# Altium schematic sheet Power Meter.SchDoc: Power Meter
size A2; ApprovedBy: JTS; CheckedBy: JTS; DrawnBy: EBC; DocumentNumber: -; Revision: 09; SheetNumber: 3; SheetTotal: 7; SenaiProjectName: EzPower v4
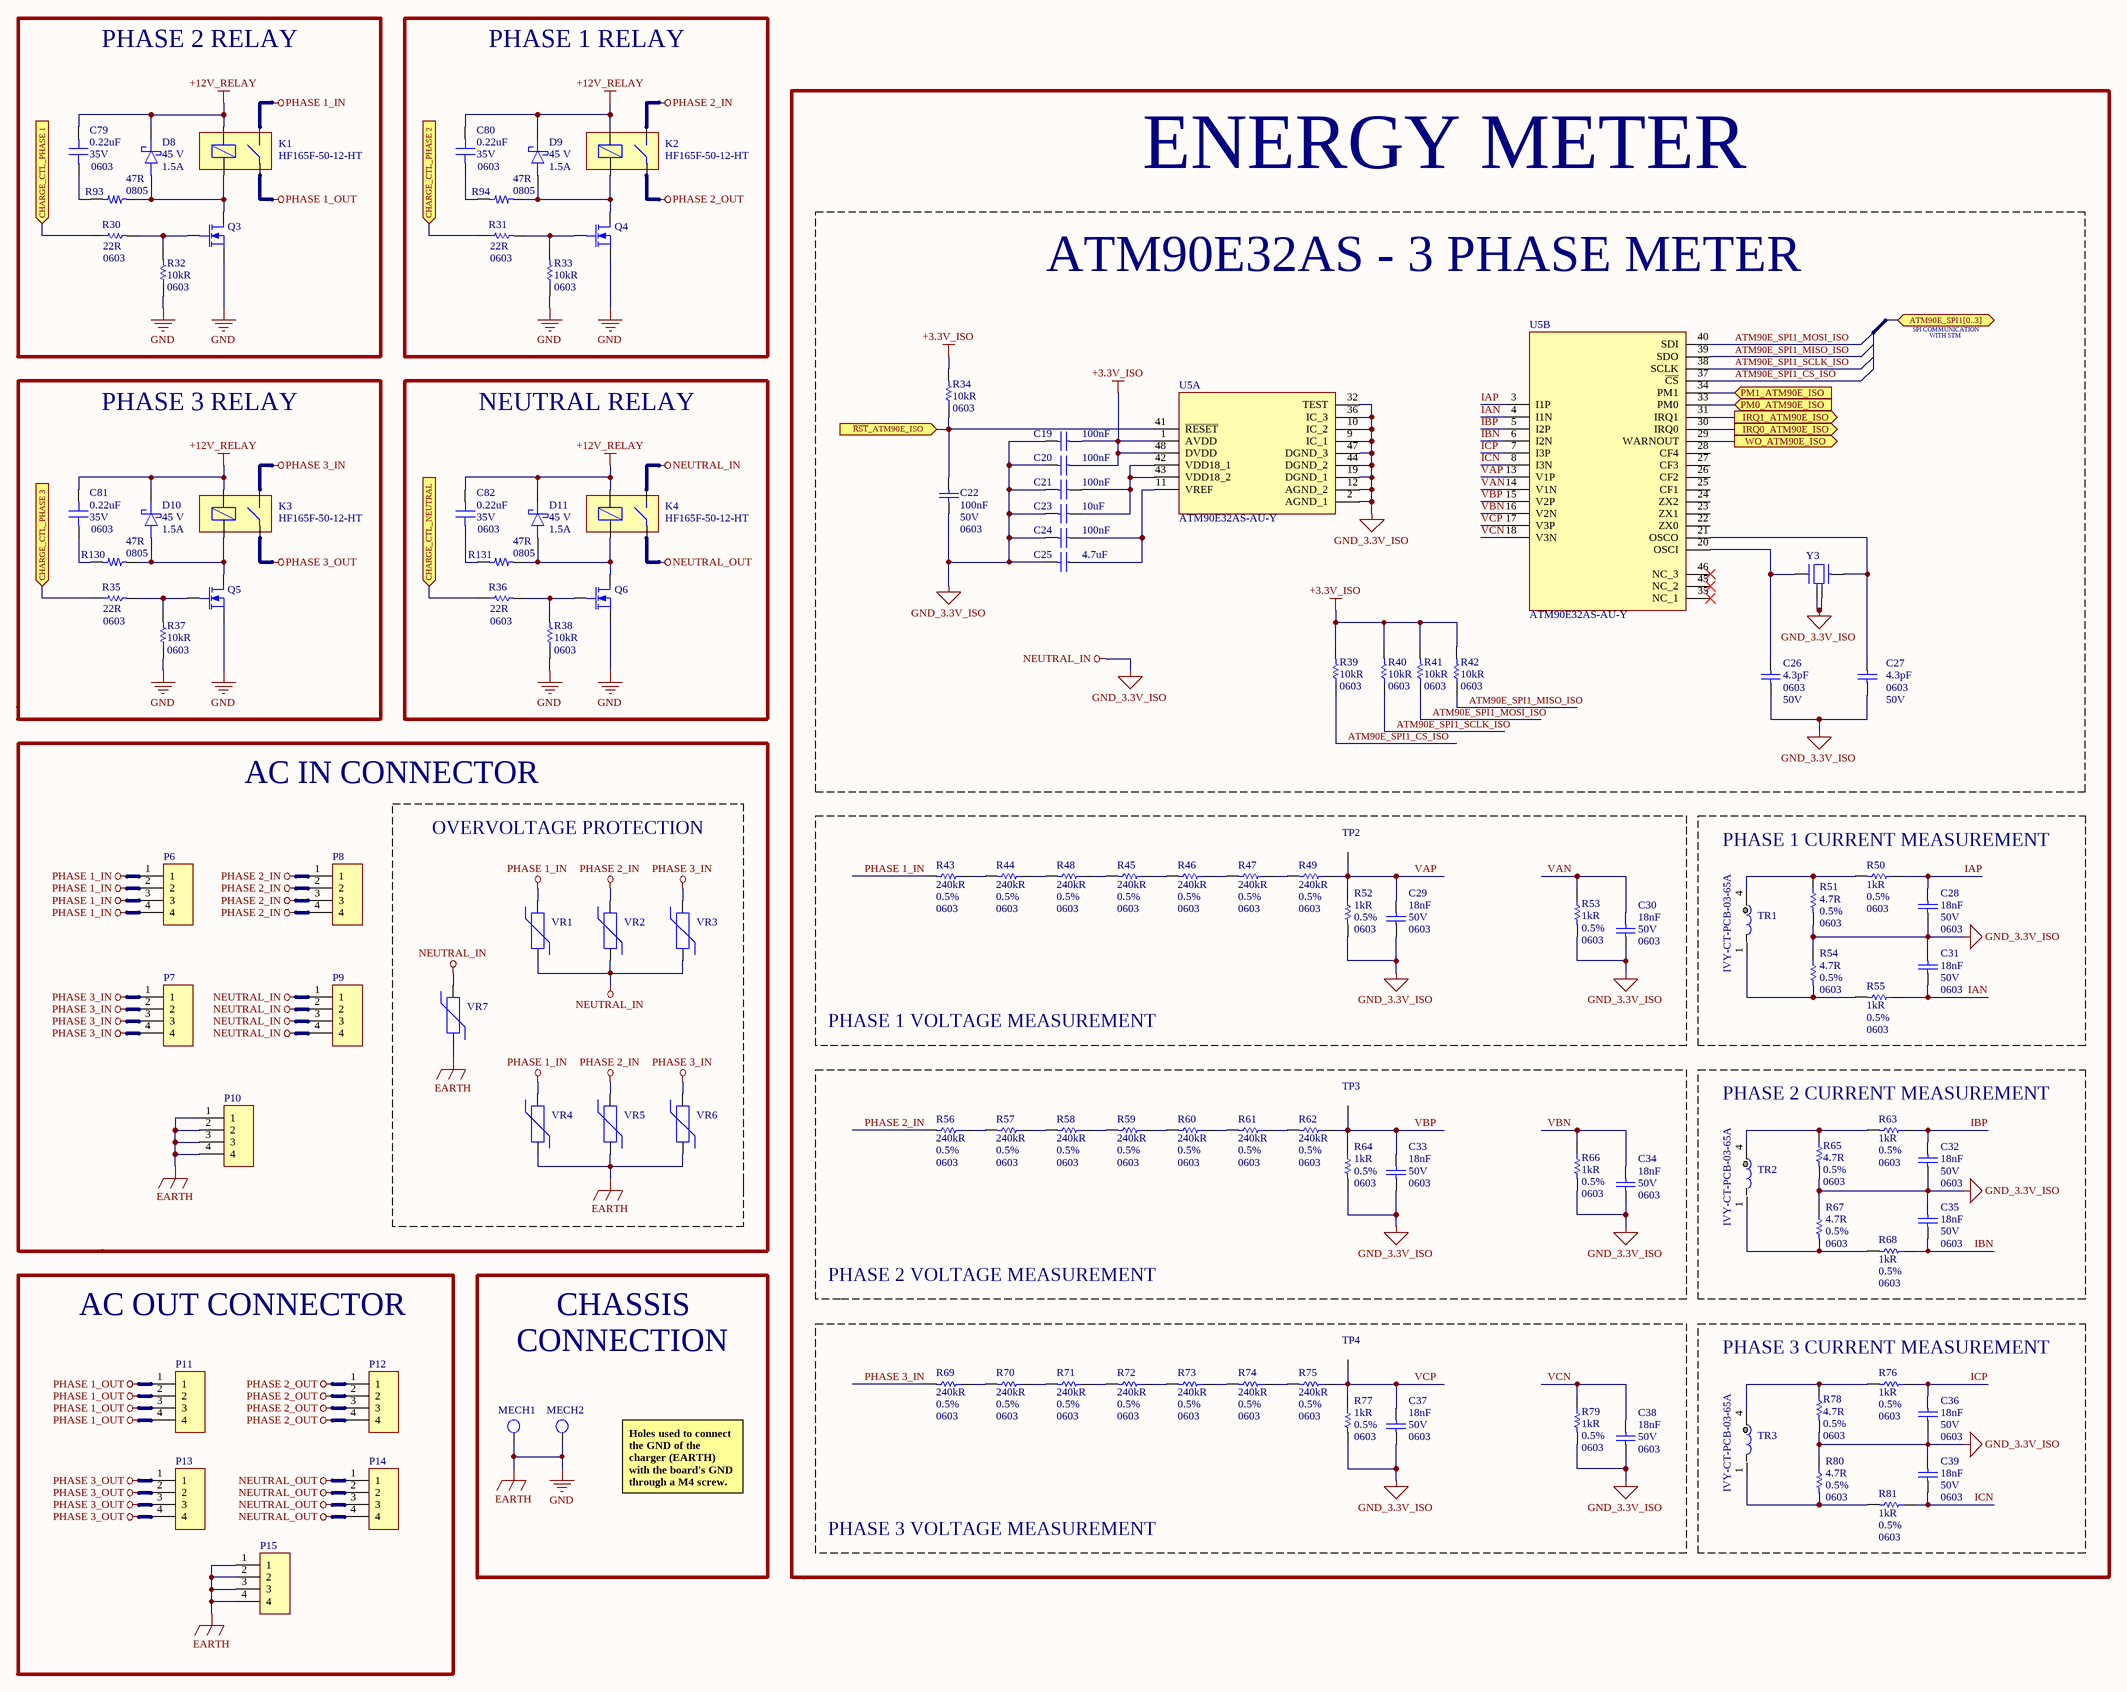
[diagram p0: Power Meter.SchDoc]

## Parts
C19  value 100nF  [C0603]  (hidden comment: CC0603MRX7R9BB104)
C20  value 100nF  [C0603]  (hidden comment: CC0603MRX7R9BB104)
C21  value 100nF  [C0603]  (hidden comment: CC0603MRX7R9BB104)
C22  value 100nF  Case/Package: 0603  Voltage Rating: 50V  [C0603]  (hidden comment: CC0603MRX7R9BB104)
C23  Capacitance: 10uF  [C0603]  (hidden comment: C_0603_10uF_35V_20%)
C24  value 100nF  [C0603]  (hidden comment: CC0603MRX7R9BB104)
C25  value 4.7uF  [C0603]  (hidden comment: CL10A475KO8NNNC)
C26  value 4.3pF  Case Code (Imperial): 0603  Voltage Rating: 50V  [C0603]  (hidden comment: CC0603CRNPO9BN4R3)
C27  value 4.3pF  Case Code (Imperial): 0603  Voltage Rating: 50V  [C0603]  (hidden comment: CC0603CRNPO9BN4R3)
C28  value 18nF  Voltage Rating: 50V  Case/Package: 0603  [C0603]  (hidden comment: CC0603JRX7R9BB183)
C29  value 18nF  Voltage Rating: 50V  Case/Package: 0603  [C0603]  (hidden comment: CC0603JRX7R9BB183)
C30  value 18nF  Voltage Rating: 50V  Case/Package: 0603  [C0603]  (hidden comment: CC0603JRX7R9BB183)
C31  value 18nF  Voltage Rating: 50V  Case/Package: 0603  [C0603]  (hidden comment: CC0603JRX7R9BB183)
C32  value 18nF  Voltage Rating: 50V  Case/Package: 0603  [C0603]  (hidden comment: CC0603JRX7R9BB183)
C33  value 18nF  Voltage Rating: 50V  Case/Package: 0603  [C0603]  (hidden comment: CC0603JRX7R9BB183)
C34  value 18nF  Voltage Rating: 50V  Case/Package: 0603  [C0603]  (hidden comment: CC0603JRX7R9BB183)
C35  value 18nF  Voltage Rating: 50V  Case/Package: 0603  [C0603]  (hidden comment: CC0603JRX7R9BB183)
C36  value 18nF  Voltage Rating: 50V  Case/Package: 0603  [C0603]  (hidden comment: CC0603JRX7R9BB183)
C37  value 18nF  Voltage Rating: 50V  Case/Package: 0603  [C0603]  (hidden comment: CC0603JRX7R9BB183)
C38  value 18nF  Voltage Rating: 50V  Case/Package: 0603  [C0603]  (hidden comment: CC0603JRX7R9BB183)
C39  value 18nF  Voltage Rating: 50V  Case/Package: 0603  [C0603]  (hidden comment: CC0603JRX7R9BB183)
C79  Parameter 1: 0.22uF  Parameter 2: 35V  Package: 0603  [CAPC 0603/1608]  (hidden comment: Capacitor)
C80  Parameter 1: 0.22uF  Parameter 2: 35V  Package: 0603  [CAPC 0603/1608]  (hidden comment: Capacitor)
C81  Parameter 1: 0.22uF  Parameter 2: 35V  Package: 0603  [CAPC 0603/1608]  (hidden comment: Capacitor)
C82  Parameter 1: 0.22uF  Parameter 2: 35V  Package: 0603  [CAPC 0603/1608]  (hidden comment: Capacitor)
D8  Voltage: 45 V  Current: 1.5A  [DO-214AC-2]  (hidden comment: BYS10-45HE3_A/H)
D9  Voltage: 45 V  Current: 1.5A  [DO-214AC-2]  (hidden comment: BYS10-45HE3_A/H)
D10  Voltage: 45 V  Current: 1.5A  [DO-214AC-2]  (hidden comment: BYS10-45HE3_A/H)
D11  Voltage: 45 V  Current: 1.5A  [DO-214AC-2]  (hidden comment: BYS10-45HE3_A/H)
K1  HF165F-50-12-HT  [HF165F-50 12-HT]
K2  HF165F-50-12-HT  [HF165F-50 12-HT]
K3  HF165F-50-12-HT  [HF165F-50 12-HT]
K4  HF165F-50-12-HT  [HF165F-50 12-HT]
MECH1  MECH-Screw-M4  [MECH-M4]  (value not drawn)
MECH2  MECH-Screw-M4  [MECH-M4]  (value not drawn)
P6  PCB-15  [Connector POWER PCB-15]  (value not drawn)
P7  PCB-15  [Connector POWER PCB-15]  (value not drawn)
P8  PCB-15  [Connector POWER PCB-15]  (value not drawn)
P9  PCB-15  [Connector POWER PCB-15]  (value not drawn)
P10  PCB-15  [Connector POWER PCB-15]  (value not drawn)
P11  PCB-15  [Connector POWER PCB-15]  (value not drawn)
P12  PCB-15  [Connector POWER PCB-15]  (value not drawn)
P13  PCB-15  [Connector POWER PCB-15]  (value not drawn)
P14  PCB-15  [Connector POWER PCB-15]  (value not drawn)
P15  PCB-15  [Connector POWER PCB-15]  (value not drawn)
Q3  RSF015N06FRATL  [TUMT-3]  (value not drawn)
Q4  RSF015N06FRATL  [TUMT-3]  (value not drawn)
Q5  RSF015N06FRATL  [TUMT-3]  (value not drawn)
Q6  RSF015N06FRATL  [TUMT-3]  (value not drawn)
R30  Resistance: 22R  Case Code (Imperial): 0603  [R0603]  (hidden comment: CRCW060322R0FKEAC)
R31  Resistance: 22R  Case Code (Imperial): 0603  [R0603]  (hidden comment: CRCW060322R0FKEAC)
R32  value 10kR  Case/Package: 0603  [R0603]  (hidden comment: CRCW060310K0JNEBC)
R33  value 10kR  Case/Package: 0603  [R0603]  (hidden comment: CRCW060310K0JNEBC)
R34  value 10kR  Case/Package: 0603  [R0603]  (hidden comment: CRCW060310K0JNEBC)
R35  Resistance: 22R  Case Code (Imperial): 0603  [R0603]  (hidden comment: CRCW060322R0FKEAC)
R36  Resistance: 22R  Case Code (Imperial): 0603  [R0603]  (hidden comment: CRCW060322R0FKEAC)
R37  value 10kR  Case/Package: 0603  [R0603]  (hidden comment: CRCW060310K0JNEBC)
R38  value 10kR  Case/Package: 0603  [R0603]  (hidden comment: CRCW060310K0JNEBC)
R39  value 10kR  Case/Package: 0603  [R0603]  (hidden comment: CRCW060310K0JNEBC)
R40  value 10kR  Case/Package: 0603  [R0603]  (hidden comment: CRCW060310K0JNEBC)
R41  value 10kR  Case/Package: 0603  [R0603]  (hidden comment: CRCW060310K0JNEBC)
R42  value 10kR  Case/Package: 0603  [R0603]  (hidden comment: CRCW060310K0JNEBC)
R43  value 240kR  Tolerance: 0.5%  Case Code (Imperial): 0603  [R0603]  (hidden comment: RR0816P-244-D)
R44  value 240kR  Tolerance: 0.5%  Case Code (Imperial): 0603  [R0603]  (hidden comment: RR0816P-244-D)
R45  value 240kR  Tolerance: 0.5%  Case Code (Imperial): 0603  [R0603]  (hidden comment: RR0816P-244-D)
R46  value 240kR  Tolerance: 0.5%  Case Code (Imperial): 0603  [R0603]  (hidden comment: RR0816P-244-D)
R47  value 240kR  Tolerance: 0.5%  Case Code (Imperial): 0603  [R0603]  (hidden comment: RR0816P-244-D)
R48  value 240kR  Tolerance: 0.5%  Case Code (Imperial): 0603  [R0603]  (hidden comment: RR0816P-244-D)
R49  value 240kR  Tolerance: 0.5%  Case Code (Imperial): 0603  [R0603]  (hidden comment: RR0816P-244-D)
R50  value 1kR  Case/Package: 0603  Resistance Tolerance: 0.5%  [R0603]  (hidden comment: RR0816P-102-D)
R51  value 4.7R  Tolerance: 0.5%  Case/Package: 0603  [R0603]  (hidden comment: R_0603_4.7R_0.5%_1/10W)
R52  value 1kR  Case/Package: 0603  Resistance Tolerance: 0.5%  [R0603]  (hidden comment: RR0816P-102-D)
R53  value 1kR  Case/Package: 0603  Resistance Tolerance: 0.5%  [R0603]  (hidden comment: RR0816P-102-D)
R54  value 4.7R  Tolerance: 0.5%  Case/Package: 0603  [R0603]  (hidden comment: R_0603_4.7R_0.5%_1/10W)
R55  value 1kR  Case/Package: 0603  Resistance Tolerance: 0.5%  [R0603]  (hidden comment: RR0816P-102-D)
R56  value 240kR  Tolerance: 0.5%  Case Code (Imperial): 0603  [R0603]  (hidden comment: RR0816P-244-D)
R57  value 240kR  Tolerance: 0.5%  Case Code (Imperial): 0603  [R0603]  (hidden comment: RR0816P-244-D)
R58  value 240kR  Tolerance: 0.5%  Case Code (Imperial): 0603  [R0603]  (hidden comment: RR0816P-244-D)
R59  value 240kR  Tolerance: 0.5%  Case Code (Imperial): 0603  [R0603]  (hidden comment: RR0816P-244-D)
R60  value 240kR  Tolerance: 0.5%  Case Code (Imperial): 0603  [R0603]  (hidden comment: RR0816P-244-D)
R61  value 240kR  Tolerance: 0.5%  Case Code (Imperial): 0603  [R0603]  (hidden comment: RR0816P-244-D)
R62  value 240kR  Tolerance: 0.5%  Case Code (Imperial): 0603  [R0603]  (hidden comment: RR0816P-244-D)
R63  value 1kR  Case/Package: 0603  Resistance Tolerance: 0.5%  [R0603]  (hidden comment: RR0816P-102-D)
R64  value 1kR  Case/Package: 0603  Resistance Tolerance: 0.5%  [R0603]  (hidden comment: RR0816P-102-D)
R65  value 4.7R  Tolerance: 0.5%  Case/Package: 0603  [R0603]  (hidden comment: R_0603_4.7R_0.5%_1/10W)
R66  value 1kR  Case/Package: 0603  Resistance Tolerance: 0.5%  [R0603]  (hidden comment: RR0816P-102-D)
R67  value 4.7R  Tolerance: 0.5%  Case/Package: 0603  [R0603]  (hidden comment: R_0603_4.7R_0.5%_1/10W)
R68  value 1kR  Case/Package: 0603  Resistance Tolerance: 0.5%  [R0603]  (hidden comment: RR0816P-102-D)
R69  value 240kR  Tolerance: 0.5%  Case Code (Imperial): 0603  [R0603]  (hidden comment: RR0816P-244-D)
R70  value 240kR  Tolerance: 0.5%  Case Code (Imperial): 0603  [R0603]  (hidden comment: RR0816P-244-D)
R71  value 240kR  Tolerance: 0.5%  Case Code (Imperial): 0603  [R0603]  (hidden comment: RR0816P-244-D)
R72  value 240kR  Tolerance: 0.5%  Case Code (Imperial): 0603  [R0603]  (hidden comment: RR0816P-244-D)
R73  value 240kR  Tolerance: 0.5%  Case Code (Imperial): 0603  [R0603]  (hidden comment: RR0816P-244-D)
R74  value 240kR  Tolerance: 0.5%  Case Code (Imperial): 0603  [R0603]  (hidden comment: RR0816P-244-D)
R75  value 240kR  Tolerance: 0.5%  Case Code (Imperial): 0603  [R0603]  (hidden comment: RR0816P-244-D)
R76  value 1kR  Case/Package: 0603  Resistance Tolerance: 0.5%  [R0603]  (hidden comment: RR0816P-102-D)
R77  value 1kR  Case/Package: 0603  Resistance Tolerance: 0.5%  [R0603]  (hidden comment: RR0816P-102-D)
R78  value 4.7R  Tolerance: 0.5%  Case/Package: 0603  [R0603]  (hidden comment: R_0603_4.7R_0.5%_1/10W)
R79  value 1kR  Case/Package: 0603  Resistance Tolerance: 0.5%  [R0603]  (hidden comment: RR0816P-102-D)
R80  value 4.7R  Tolerance: 0.5%  Case/Package: 0603  [R0603]  (hidden comment: R_0603_4.7R_0.5%_1/10W)
R81  value 1kR  Case/Package: 0603  Resistance Tolerance: 0.5%  [R0603]  (hidden comment: RR0816P-102-D)
R93  Parameter 2: 0805  Parameter 1: 47R  [RESC 0805/2012]  (hidden comment: Resistor)
R94  Parameter 2: 0805  Parameter 1: 47R  [RESC 0805/2012]  (hidden comment: Resistor)
R130  Parameter 2: 0805  Parameter 1: 47R  [RESC 0805/2012]  (hidden comment: Resistor)
R131  Parameter 2: 0805  Parameter 1: 47R  [RESC 0805/2012]  (hidden comment: Resistor)
TP2  S2761-46R  [TP_S276146R]  (value not drawn)
TP3  S2761-46R  [TP_S276146R]  (value not drawn)
TP4  S2761-46R  [TP_S276146R]  (value not drawn)
TR1  IVY-CT-PCB-03-65A  [CT IVY]
TR2  IVY-CT-PCB-03-65A  [CT IVY]
TR3  IVY-CT-PCB-03-65A  [CT IVY]
U5  Manufacturer Part Number: ATM90E32AS-AU-Y  [TQFP-48]  (hidden comment: ATM90E32AS)  (parts A,B of 2)
VR1  B72650M0271K072  [MOV3225]  (value not drawn)
VR2  B72650M0271K072  [MOV3225]  (value not drawn)
VR3  B72650M0271K072  [MOV3225]  (value not drawn)
VR4  B72650M0271K072  [MOV3225]  (value not drawn)
VR5  B72650M0271K072  [MOV3225]  (value not drawn)
VR6  B72650M0271K072  [MOV3225]  (value not drawn)
VR7  B72650M0271K072  [MOV3225]  (value not drawn)
Y3  Y_16.384MHZ  [Y50MHz]  (value not drawn)

## Blocks framed on the sheet
PHASE 2 RELAY: C79 D8 K1 Q3 R30 R32 R93
PHASE 1 RELAY: C80 D9 K2 Q4 R31 R33 R94
ATM90E32AS - 3 PHASE METER: C19-C27 R34 R39-R42 U5 Y3
NEUTRAL RELAY: C82 D11 K4 Q6 R36 R38 R131
AC IN CONNECTOR: P6-P10 VR1-VR7
PHASE 1 VOLTAGE MEASUREMENT: C29 C30 R43-R49 R52 R53 TP2
PHASE 1 CURRENT MEASUREMENT: C28 C31 R50 R51 R54 R55 TR1
PHASE 2 VOLTAGE MEASUREMENT: C33 C34 R56-R62 R64 R66 TP3
PHASE 2 CURRENT MEASUREMENT: C32 C35 R63 R65 R67 R68 TR2
AC OUT CONNECTOR: P11-P15
PHASE 3 VOLTAGE MEASUREMENT: C37 C38 R69-R75 R77 R79 TP4
PHASE 3 CURRENT MEASUREMENT: C36 C39 R76 R78 R80 R81 TR3

## Ports
ATM90E_SPI1[0..3] (bidir), CHARGE_CTL_NEUTRAL (in), CHARGE_CTL_PHASE 1 (in), CHARGE_CTL_PHASE 2 (in), CHARGE_CTL_PHASE 3 (in), IRQ0_ATM90E_ISO (out), IRQ1_ATM90E_ISO (out), PM0_ATM90E_ISO (in), PM1_ATM90E_ISO (in), WO_ATM90E_ISO (out), ~{RST}_ATM90E_ISO (in)

## Nets
+3.3V_ISO: C19.2 C20.2 R34.2 R39.2 R40.2 R41.2 R42.2 U5.1(AVDD) U5.48(DVDD)
+12V_RELAY: C79.2 C80.2 C81.2 C82.2 D8.1(K) D9.1(K) D10.1(K) D11.1(K) K1.3(A1) K2.3(A1) K3.3(A1) K4.3(A1)
EARTH: MECH1.1 MECH2.1 P10.1 P10.2 P10.3 P10.4 P15.1 P15.2 P15.3 P15.4 Q3.2(S) Q4.2(S) Q5.2(S) Q6.2(S) R32.1 R33.1 R37.1 R38.1 VR4.2 VR5.2 VR6.2 VR7.2  [also labelled GND]
GND_3.3V_ISO: C19.1 C20.1 C21.1 C22.2 C23.2 C24.1 C25.2 C26.1 C27.1 C28.2 C29.2 C30.2 C31.1 C32.2 C33.2 C34.2 C35.1 C36.2 C37.2 C38.2 C39.1 K4.1(NO) P9.1 P9.2 P9.3 P9.4 R51.2 R52.2 R53.2 R54.1 R64.2 R65.2 R66.2 R67.1 R77.2 R78.2 R79.2 R80.1 U5.2(AGND_1) U5.9(IC_1) U5.10(IC_2) U5.12(AGND_2) U5.19(DGND_1) U5.32(TEST) U5.36(IC_3) U5.44(DGND_2) U5.47(DGND_3) VR1.2 VR2.2 VR3.2 VR7.1 Y3.2 Y3.4  [also labelled NEUTRAL_IN]
NEUTRAL_OUT: K4.2(C) P14.1 P14.2 P14.3 P14.4
PHASE 1_IN: K1.1(NO) P6.1 P6.2 P6.3 P6.4 R43.2 VR1.1 VR4.1
PHASE 1_OUT: K1.2(C) P11.1 P11.2 P11.3 P11.4
PHASE 2_IN: K2.1(NO) P8.1 P8.2 P8.3 P8.4 R56.2 VR2.1 VR5.1
PHASE 2_OUT: K2.2(C) P12.1 P12.2 P12.3 P12.4
PHASE 3_IN: K3.1(NO) P7.1 P7.2 P7.3 P7.4 R69.2 VR3.1 VR6.1
PHASE 3_OUT: K3.2(C) P13.1 P13.2 P13.3 P13.4
ATM90E_SPI1_CS_ISO: R39.1 U5.37(~{CS})
ATM90E_SPI1_MISO_ISO: R42.1 U5.39(SDO)
ATM90E_SPI1_MOSI_ISO: R41.1 U5.40(SDI)
ATM90E_SPI1_SCLK_ISO: R40.1 U5.38(SCLK)
CHARGE_CTL_NEUTRAL: R36.1 ; port CHARGE_CTL_NEUTRAL
CHARGE_CTL_PHASE 1: R30.1 ; port CHARGE_CTL_PHASE 1
CHARGE_CTL_PHASE 2: R31.1 ; port CHARGE_CTL_PHASE 2
CHARGE_CTL_PHASE 3: R35.1 ; port CHARGE_CTL_PHASE 3
IAN: C31.2 R55.1 U5.4(I1N)
IAP: C28.1 R50.1 U5.3(I1P)
IBN: C35.2 R68.1 U5.6(I2N)
IBP: C32.1 R63.1 U5.5(I2P)
ICN: C39.2 R81.1 U5.8(I3N)
ICP: C36.1 R76.1 U5.7(I3P)
IRQ0_ATM90E_ISO: U5.30(IRQ0) ; port IRQ0_ATM90E_ISO
IRQ1_ATM90E_ISO: U5.31(IRQ1) ; port IRQ1_ATM90E_ISO
PM0_ATM90E_ISO: U5.33(PM0) ; port PM0_ATM90E_ISO
PM1_ATM90E_ISO: U5.34(PM1) ; port PM1_ATM90E_ISO
~{RST}_ATM90E_ISO: C22.1 R34.1 U5.41(~{RESET}) ; port ~{RST}_ATM90E_ISO
VAN: C30.1 R53.1 U5.14(V1N)
VAP: C29.1 R49.1 R52.1 TP2.1 U5.13(V1P)
VBN: C34.1 R66.1 U5.16(V2N)
VBP: C33.1 R62.1 R64.1 TP3.1 U5.15(V2P)
VCN: C38.1 R79.1 U5.18(V3N)
VCP: C37.1 R75.1 R77.1 TP4.1 U5.17(V3P)
WO_ATM90E_ISO: U5.29(WARNOUT) ; port WO_ATM90E_ISO
NetC21_2: C21.2 C23.1 U5.42(VDD18_1) U5.43(VDD18_2)
NetC24_2: C24.2 C25.1 U5.11(VREF)
NetC26_2: C26.2 U5.20(OSCI) Y3.1
NetC27_2: C27.2 U5.21(OSCO) Y3.3
NetC79_1: C79.1 R93.2
NetC80_1: C80.1 R94.2
NetC81_1: C81.1 R130.2
NetC82_1: C82.1 R131.2
NetD8_2: D8.2(A) K1.4(A2) Q3.3(D) R93.1
NetD9_2: D9.2(A) K2.4(A2) Q4.3(D) R94.1
NetD10_2: D10.2(A) K3.4(A2) Q5.3(D) R130.1
NetD11_2: D11.2(A) K4.4(A2) Q6.3(D) R131.1
NetQ3_1: Q3.1(G) R30.2 R32.2
NetQ4_1: Q4.1(G) R31.2 R33.2
NetQ5_1: Q5.1(G) R35.2 R37.2
NetQ6_1: Q6.1(G) R36.2 R38.2
NetR43_1: R43.1 R44.2
NetR44_1: R44.1 R48.2
NetR45_1: R45.1 R46.2
NetR45_2: R45.2 R48.1
NetR46_1: R46.1 R47.2
NetR47_1: R47.1 R49.2
NetR50_2: R50.2 R51.1 TR1.4(K)
NetR54_2: R54.2 R55.2 TR1.1(I)
NetR56_1: R56.1 R57.2
NetR57_1: R57.1 R58.2
NetR58_1: R58.1 R59.2
NetR59_1: R59.1 R60.2
NetR60_1: R60.1 R61.2
NetR61_1: R61.1 R62.2
NetR63_2: R63.2 R65.1 TR2.4(K)
NetR67_2: R67.2 R68.2 TR2.1(I)
NetR69_1: R69.1 R70.2
NetR70_1: R70.1 R71.2
NetR71_1: R71.1 R72.2
NetR72_1: R72.1 R73.2
NetR73_1: R73.1 R74.2
NetR74_1: R74.1 R75.2
NetR76_2: R76.2 R78.1 TR3.4(K)
NetR80_2: R80.2 R81.2 TR3.1(I)

Not connected (* = marked no-connect by the designer): U5 22(ZX0) 23(ZX1) 24(ZX2) 25(CF1) 26(CF2) 27(CF3) 28(CF4) 35(NC_1)* 45(NC_2)* 46(NC_3)*

## Notes on the sheet
- ENERGY METER
- SPI COMMUNICATION
- WITH STM
- PHASE 3 RELAY
- OVERVOLTAGE PROTECTION
- CONNECTION
- CHASSIS
- Holes used to connect the GND of the charger (EARTH) with the board's GND through a M4 screw.
- Title:
- Size:
- Project:
- Revision:
- Date:
- Time:
- Variant:
- Drawn by:
- Checked by:
- A2
- Approved by:
- Sheet
- of

## Library data of the parts
C19-C22 C24 = C_0603_0.1uF_50V_20%: Cap Ceramic 50V 20% +Tol 20% -Tol X7R 15% TC 0.1uF SMD 0603; Manufacturer: Yageo; Supplier 1: Arrow Electronics; Manufacturer Part Number: CC0603MRX7R9BB104; RoHS: Yes; Category: Ceramic Capacitors; Stock 1: 19775; Pricing 1: 4000=0,00850, 8000=0,00780, 12000=0,00740, 28000=0,00700, 100000=0,00520 (USD); Mounting Technology: Surface Mount; Case Code (Imperial): 0603; Case Code (Metric): 1608; Min Operating Temperature: -55°C; Max Operating Temperature: 125°C; Packaging: Tape and Reel; Tolerance: 20%; Dielectric: X7R; Voltage Rating (DC): 50V; Series: CC; Length: 0.063inch; Width: 0.031inch; Thickness: 0.035inch; Lead Free: Lead Free; Halogen Free: Halogen Free; RoHS Compliant: Yes; ComponentLink1URL: http://www.yageo.com/documents/recent/UPY-GPHC_X7R_6.3V-to-50V_18.pdf?src-supplier=Digi-Key; ComponentLink1Description: http://www.yageo.com/documents/recent/UPY-GPHC_X7R_6.3V-to-50V_18.pdf?src-supplier=Digi-Key; ComponentLink2URL: https://www.yageo.com/upload/media/product/productsearch/datasheet/mlcc/UPY-GPHC_X7R_6.3V-to-50V_18.pdf?src-supplier=Digi-Key; ComponentLink2Description: https://www.yageo.com/upload/media/product/productsearch/datasheet/mlcc/UPY-GPHC_X7R_6.3V-to-50V_18.pdf?src-supplier=Digi-Key; ComponentLink3URL: http://www.yageo.com/exep/pages/download/literatures/ProductSelectionGuide%202014_Final_2.pdf?src-supplier=Digi-Key; ComponentLink3Description: http://www.yageo.com/exep/pages/download/literatures/ProductSelectionGuide%202014_Final_2.pdf?src-supplier=Digi-Key; Supplier Part Number 1: CC0603MRX7R9BB104
C23 = C_0603_10uF_35V_20%: Cap Ceramic 10uF 35V X5R 20% Pad SMD 0603 85C T/R; Manufacturer: Murata; Manufacturer Part Number: GRM188R6YA106MA73D; Supplier 1: Arrow Electronics; RoHS: Yes; Category: Ceramic Capacitors; Stock 1: 32291; Pricing 1: 1=0,31230, 10=0,18330, 25=0,18150, 100=0,12390, 250=0,12260, 500=0,08640, 1000=0,08550, 3000=0,07600, 6000=0,06650, 15000=0,06580, 30000=0,05360 (USD); Mount: Surface Mount; Case Code (Metric): 1608; Case Code (Imperial): 0603; Min Operating Temperature: -55°C; Max Operating Temperature: 85°C; Packaging: Tape and Reel; Voltage Rating (DC): 35V; Dielectric: X5R; Length: 0.063inch; Width: 0.031inch; Thickness: 0.039inch; RoHS Compliant: Yes; ComponentLink1URL: http://search.murata.co.jp/Ceramy/image/img/A01X/G101/ENG/GRM188R6YA106MA73-01.pdf?src-supplier=Future+Electronics; ComponentLink1Description: http://search.murata.co.jp/Ceramy/image/img/A01X/G101/ENG/GRM188R6YA106MA73-01.pdf?src-supplier=Future+Electronics; ComponentLink2URL: http://search.murata.co.jp/Ceramy/image/img/A01X/G101/ENG/GRM188R6YA106MA73-01.pdf?src-supplier=Digi-Key; ComponentLink2Description: http://search.murata.co.jp/Ceramy/image/img/A01X/G101/ENG/GRM188R6YA106MA73-01.pdf?src-supplier=Digi-Key; ComponentLink3URL: https://www.murata.com/~/media/webrenewal/support/library/catalog/products/capacitor/mlcc/c02e.ashx?la=en-us&src-supplier=Digi-Key; ComponentLink3Description: https://www.murata.com/~/media/webrenewal/support/library/catalog/products/capacitor/mlcc/c02e.ashx?la=en-us&src-supplier=Digi-Key; ComponentLink4URL: http://search.murata.co.jp/Ceramy/image/img/A01X/G101/ENG/GRM188R6YA106MA73-01.pdf?src-supplier=Mouser; ComponentLink4Description: http://search.murata.co.jp/Ceramy/image/img/A01X/G101/ENG/GRM188R6YA106MA73-01.pdf?src-supplier=Mouser; ComponentLink5URL: http://search.murata.co.jp/Ceramy/image/img/A01X/G101/ENG/GRM188R6YA106MA73-01.pdf?src-supplier=TTI; ComponentLink5Description: http://search.murata.co.jp/Ceramy/image/img/A01X/G101/ENG/GRM188R6YA106MA73-01.pdf?src-supplier=TTI; Tolerance: 20%; Supplier Part Number 1: GRM188R6YA106MA73D
C25 = C_0603_4.7uF_16V_10%: CAP CER 4.7UF 16V X5R 0603; Manufacturer: Samsung; Material: Ceramic; Tolerance: 10%; Supplier 1: Mouser; Manufacturer Part Number: CL10A475KO8NNNC; RoHS: Yes; Category: Ceramic Capacitors; Stock 1: 437083; Pricing 1: 1=0,12000, 10=0,08600, 50=0,08600, 100=0,04100, 1000=0,02400, 10000=0,01700 (USD); Mounting Technology: Surface Mount; Case/Package: 0603; Case Code (Metric): 1608; Contact Plating: Tin; Min Operating Temperature: -55°C; Max Operating Temperature: 85°C; Packaging: Tape and Reel; Package Quantity: 1; Dielectric: X5R; Voltage: 16V; Construction: Flat; Length: 1.6mm; Width: 0.031inch; Height: 0.8mm; Thickness: 0.035inch; Depth: 0.8mm; Radiation Hardening: No; RoHS Compliant: Yes; Supplier Part Number 1: 187-CL10A475KO8NNNC; Series: CL; Case Code (Imperial): 0603; Voltage Rating: 16V
C26 C27 = C_0603_4.3pF_±0.25pF_50V: Cap Ceramic 4.3pF 50V C0G 0.25pF Pad SMD 0603 125C T/R; Manufacturer: Yageo; Supplier 1: Future Electronics; Manufacturer Part Number: CC0603CRNPO9BN4R3; RoHS: Yes; Category: Ceramic Capacitors; Stock 1: 264000; Pricing 1: 4000=0,0051, 16000=0,0048, 60000=0,0045, 160000=0,0043, 400000=0,0041 (USD); Mounting Technology: Surface Mount; Case/Package: 0603; Case Code (Metric): 1608; Min Operating Temperature: -55°C; Max Operating Temperature: 125°C; Packaging: Cut Tape; Series: CC; Length: 0.063inch; Width: 0.031inch; Thickness: 0.035inch; ComponentLink1URL: http://www.yageo.com/documents/recent/UPY-GP_NP0_16V-to-50V_16.pdf?src-supplier=Digi-Key; ComponentLink1Description: http://www.yageo.com/documents/recent/UPY-GP_NP0_16V-to-50V_16.pdf?src-supplier=Digi-Key; ComponentLink2URL: https://www.yageo.com/upload/media/product/productsearch/datasheet/mlcc/UPY-GP_NP0_16V-to-50V_18.pdf?src-supplier=Digi-Key; ComponentLink2Description: https://www.yageo.com/upload/media/product/productsearch/datasheet/mlcc/UPY-GP_NP0_16V-to-50V_18.pdf?src-supplier=Digi-Key; ComponentLink3URL: http://www.yageo.com/exep/pages/download/literatures/ProductSelectionGuide%202014_Final_2.pdf?src-supplier=Digi-Key; ComponentLink3Description: http://www.yageo.com/exep/pages/download/literatures/ProductSelectionGuide%202014_Final_2.pdf?src-supplier=Digi-Key; Supplier Part Number 1: 5130881
C28-C39 = C_0603_0.018uF_50V_5%_: 0603 18 nF 50 V ±5 % Tolerance X7R SMT Multilayer Ceramic Capacitor; Manufacturer: Yageo; Tolerance: 5%; Supplier: Arrow Electronics; Supplier Part Number: CC0603JRX7R9BB183; Manufacturer Part Number: CC0603JRX7R9BB183; RoHS: Yes; Category: Ceramic Capacitors; Stock: 6844; Pricing: 1=0,12080, 10=0,04830, 25=0,04780, 100=0,02790, 250=0,02760, 500=0,02650, 1000=0,02180, 3000=0,02080, 6000=0,01790 (USD); Mounting Technology: Surface Mount; Case Code (Imperial): 0603; Case Code (Metric): 1608; Weight: 7.1E-05oz; Min Operating Temperature: -55°C; Max Operating Temperature: 125°C; Packaging: Tape and Reel; Series: CC; Voltage Rating (DC): 50V; Dielectric: X7R; Termination: SMD/SMT; Construction: Flat; Length: 1.6mm; Width: 0.031inch; Thickness: 0.035inch; Depth: 0.8mm; Radiation Hardening: No; RoHS Compliant: Yes; Lead Free: Lead Free; Halogen Free: Halogen Free; ComponentLink1URL: https://datasheet.ciiva.com/11465/upy-gphc-x7r-6-3v-to-50v-8-11465045.pdf?src-supplier=Avnet; ComponentLink1Description: https://datasheet.ciiva.com/11465/upy-gphc-x7r-6-3v-to-50v-8-11465045.pdf?src-supplier=Avnet; ComponentLink2URL: https://datasheet.ciiva.com/26829/getdatasheetpartid-641230-26829404.pdf?src-supplier=Verical; ComponentLink2Description: https://datasheet.ciiva.com/26829/getdatasheetpartid-641230-26829404.pdf?src-supplier=Verical
C79-C82 = C1608X7R1V224K080AB: CAPACITOR SMD CERÂMICO 0.22uF 35V X7R 0603; Manufacturer: TDK; Tolerance: ±10%; Manufacturer Part Number: C1608X7R1V224K080AB; Part Number: C1608X7R1V224K080AB; Capacitance: 0.22uF; Voltage: 35V; Revision: 0; Temperature Coefficient: X7R; Author: Esdras Bahiano
D8-D11 = D_Schottky_BYS10-45HE3_A/H: Rectifier Diode Schottky 45V 1.5A Automotive 2-Pin SMA T/R; Manufacturer: Vishay Semiconductors; Supplier 1: Mouser; RoHS: Yes; Category: Schottky Diodes; Stock 1: 42659; Pricing 1: 1=0,35000, 10=0,30200, 50=0,30200, 100=0,18900, 1000=0,09900, 10000=0,09900 (USD); RoHS Compliant: Yes; Supplier Part Number 1: 78-BYS10-45HE3_A/H; Manufacturer Part Number: BYS10-45HE3_A/H
K1-K4 = HF165F-50-12-HT: RELË PTH POWER 50A , Coil 12 V 120 Ohms; Manufacturer: HONGFA; Contact Form: SPST (1 Form A); Coil Current: 100 mA; Part Number: HF165F-50-12-HT; Manufacturer Part Number: HF165F-50 12-HT; Revision: 0; Author: Jovelino Torres
MECH1 MECH2 = MECH_Screw_M4: PCB Fastener Screws M4
P6-P15 = P_PWRCONN_M5-SCREW_4PIN: PC board of welding wire terminal, beautiful / and strong, resistance to big current , with the screw to / fix terminals.; Screw Hole: M5; Current Rating: 50A; Manufacturer Part Number: PCB-15
Q3-Q6 = Q_RSF015N06FRATL_TUMT-3: Transistor Mosfet N-ch 60V 1.5A 3-PIN Tumt T/r; Manufacturer: Rohm; Rds On Max: 290mR; Input Capacitance: 110pF; Max Power Dissipation: 800mW; Supplier 1: Newark; RoHS: Yes; Category: MOSFETs; Stock 1: 15; Pricing 1: 5=0,43000, 10=0,35700, 25=0,31900, 50=0,28100, 100=0,24300, 250=0,21300, 500=0,18300, 1000=0,13700 (USD); Mounting Technology: Surface Mount; Case/Package: SMD/SMT; Packaging: Tape and Reel; Drain to Source Voltage (Vdss): 60V; Continuous Drain Current (ID): 1.5A; ComponentLink1URL: http://rohmfs.rohm.com/en/products/databook/datasheet/discrete/transistor/mosfet/rsf015n06fra-e.pdf?src-supplier=Digi-Key; ComponentLink1Description: http://rohmfs.rohm.com/en/products/databook/datasheet/discrete/transistor/mosfet/rsf015n06fra-e.pdf?src-supplier=Digi-Key; Supplier Part Number 1: 24AC5315; Manufacturer Part Number: RSF015N06FRATL
R30 R31 R35 R36 = R_0603_22R_1%_1/10W: Thick Film Resistors - SMD 1/10Watt 22ohms 1% Commercial Use; Manufacturer: Vishay; Temperature Coefficient: 100ppm/°C; Max Power Dissipation: 100mW; Supplier 1: Mouser; Manufacturer Part Number: CRCW060322R0FKEAC; Stock 1: 59616; Pricing 1: 1=0.1, 10=0.036, 100=0.014, 500=0.009, 1000=0.005, 5000=0.004 (USD); Case/Package: 0603; Case Code (Metric): 1608; Min Operating Temperature: -55°C; Max Operating Temperature: 155°C; Composition: Thick Film; Packaging: Cut Tape; Tolerance: 1%; Number of Terminations: 2; Supplier 2: Digi-Key; Supplier Part Number 1: 71-CRCW060322R0FKEAC; Supplier Part Number 2: 541-4025-6-ND
R32-R34 R37-R42 = R_0603_10kR_5%_1/10W: Fixed Resistor, Metal Glaze/thick Film, 0.1W, 10000ohm, 75V, 5% +/-Tol, 200ppm/Cel, Surface Mount, 0603; Manufacturer: Vishay; Power: 100mW; Temperature Coefficient: -200200ppm/°C; Package Height: 0.45mm; Package Length: 1.6mm; Package Width: 0.8mm; Supplier: Mouser; Supplier Part Number: 71-CRCW060310K0JNEBC; Manufacturer Part Number: CRCW060310K0JNEBC; RoHS: Yes; Category: Chip SMD Resistors; Stock: 170759; Pricing: 1=0,1, 10=0,014, 50=0,014, 100=0,008, 1000=0,007, 10000=0,003 (USD); Pins: 2; Terminal Finish: Nickel; Min Operating Temperature: -55°C; Max Operating Temperature: 155°C; Tolerance: 5%; JESD-609 Code: e3; Resistor Type: FIXED RESISTOR; Construction: Chip; Package Style: SMTMeter; Packaging: Tape and Reel; Technology: METAL GLAZE/THICK FILM; Working Voltage: 75V; Reach SVHC Compliant: Yes; RoHS Compliant: Yes; ComponentLink1URL: https://datasheet.ciiva.com:443/pdfs/VipMasterIC/IC/VISH/VISH-S-A0003599164/VISH-S-A0003599164-1.pdf?src-supplier=IHS+Markit; ComponentLink1Description: https://datasheet.ciiva.com:443/pdfs/VipMasterIC/IC/VISH/VISH-S-A0003599164/VISH-S-A0003599164-1.pdf?src-supplier=IHS+Markit; ComponentLink2URL: http://www.vishay.com/docs/28773/crcwce3.pdf?src-supplier=Digikey; ComponentLink2Description: http://www.vishay.com/docs/28773/crcwce3.pdf?src-supplier=Digikey
R43-R49 R56-R62 R69-R75 = R_0603_240kR_0.5%_1/16W_25PPM: Res Thin Film 1.6 x 0.8 mm 240K Ohm 0.5% 0.063W(1/16W) 25ppm/ C Molded SMD T/R; Manufacturer: Susumu; Power Rating: 62.5mW; Voltage Rating: 75V; Temperature Coefficient: 25ppm/°C; Max Power Dissipation: 63mW; Supplier: Arrow Electronics; Supplier Part Number: RR0816P-244-D; Manufacturer Part Number: RR0816P-244-D; RoHS: Yes; Category: Chip SMD Resistors; Stock: 1287; Pricing: 1=0,02100, 10=0,01910, 25=0,01900, 100=0,00740, 250=0,00730, 500=0,00460, 1000=0,00320 (USD); Mounting Technology: Surface Mount; Case/Package: 0603; Pins: 2; Case Code (Metric): 1608; Min Operating Temperature: -55°C; Max Operating Temperature: 125°C; Package Quantity: 5000; Packaging: Tape and Reel; Number of Terminations: 2; Termination: SMD/SMT; Voltage Rating (DC): 75V; Series: RR; Technology: THIN FILM; Length: 0.063inch; Width: 0.031inch; Height: 0.02inch; Depth: 0.8mm; Height - Seated (Max): 0.02inch; Lead Free: Lead Free; RoHS Compliant: Yes; ComponentLink1URL: https://datasheet.ciiva.com/11820/0900766b80808d64-11820390.pdf?src-supplier=Rs; ComponentLink1Description: https://datasheet.ciiva.com/11820/0900766b80808d64-11820390.pdf?src-supplier=Rs; ComponentLink2URL: https://datasheet.ciiva.com/2487/rr-data-sheet-2487242.pdf?src-supplier=Digi-Key; ComponentLink2Description: https://datasheet.ciiva.com/2487/rr-data-sheet-2487242.pdf?src-supplier=Digi-Key; ComponentLink3URL: https://datasheet.ciiva.com/2487/rr-data-sheet-2487241.pdf?src-supplier=Digi-Key; ComponentLink3Description: https://datasheet.ciiva.com/2487/rr-data-sheet-2487241.pdf?src-supplier=Digi-Key; ComponentLink4URL: https://datasheet.ciiva.com/2487/rr-data-sheet-2487243.pdf?src-supplier=Digi-Key; ComponentLink4Description: https://datasheet.ciiva.com/2487/rr-data-sheet-2487243.pdf?src-supplier=Digi-Key
R50 R52 R53 R55 R63 R64 R66 R68 R76 R77 R79 R81 = R_0603_1kR_0.5%_1/16W_25PPM: Res Thin Film 0603 1K Ohm 0.5% 0.063W(1/16W) ±25ppm/C Pad SMD Automotive T/R; Manufacturer: Susumu; Power Rating: 63mW; Voltage Rating: 75V; Temperature Coefficient: 25ppm/°C; Supplier: Newark; Supplier Part Number: 28K0416; Manufacturer Part Number: RR0816P-102-D; RoHS: Yes; Category: Chip SMD Resistors; Stock: 10000; Pricing: 5000=0,01500 (USD); Pins: 2; Case Code (Metric): 1608; Case Code (Imperial): 0603; Min Operating Temperature: -55°C; Max Operating Temperature: 125°C; Tolerance: 0.5%; Package Quantity: 1; Packaging: Tape and Reel; Number of Terminations: 2; Termination: SMD/SMT; Max Power Dissipation: 63mW; Voltage Rating (DC): 75V; Series: RR; Resistor Type: Thin Film; Technology: THIN FILM; Length: 1.6mm; Width: 0.8mm; Height: 0.4mm; Depth: 0.8mm; Lead Free: Lead Free; RoHS Compliant: Yes; Reach SVHC Compliant: Unknown; ComponentLink1URL: https://datasheet.ciiva.com/11820/0900766b80808d64-11820651.pdf?src-supplier=Rs; ComponentLink1Description: https://datasheet.ciiva.com/11820/0900766b80808d64-11820651.pdf?src-supplier=Rs; ComponentLink2URL: https://datasheet.ciiva.com/7984/87330-7984329.pdf?src-supplier=Element14; ComponentLink2Description: https://datasheet.ciiva.com/7984/87330-7984329.pdf?src-supplier=Element14; ComponentLink3URL: https://datasheet.ciiva.com/2487/rr-data-sheet-2487026.pdf?src-supplier=Digi-Key; ComponentLink3Description: https://datasheet.ciiva.com/2487/rr-data-sheet-2487026.pdf?src-supplier=Digi-Key; ComponentLink4URL: https://datasheet.ciiva.com/2487/rr-data-sheet-2487027.pdf?src-supplier=Digi-Key; ComponentLink4Description: https://datasheet.ciiva.com/2487/rr-data-sheet-2487027.pdf?src-supplier=Digi-Key; ComponentLink5URL: https://datasheet.ciiva.com/2487/rr-data-sheet-2487025.pdf?src-supplier=Digi-Key; ComponentLink5Description: https://datasheet.ciiva.com/2487/rr-data-sheet-2487025.pdf?src-supplier=Digi-Key
R51 R54 R65 R67 R78 R80 = R_0603_4.7R_0.5%_1/10W: High Precision-High Stability Chip Resistor Thin Film 0603 4.7Ohm 0.5% Paper T/R; Manufacturer: Yageo; Manufacturer Part Number: RT0603DRD074R7L; Max Power Dissipation: 100mW; Temperature Coefficient: 25ppm/°C; ComponentLink1URL: http://www.vishay.com/docs/28773/crcwce3.pdf?src-supplier=Digi-Key; ComponentLink1Description: http://www.vishay.com/docs/28773/crcwce3.pdf?src-supplier=Digi-Key; Supplier: Mouser; Supplier Part Number: 603-RT0603DRD074R7L; RoHS: Yes; Category: Chip SMD Resistors; Stock: 3851; Pricing: 1=0,16000, 10=0,13400, 50=0,13400, 100=0,05300, 1000=0,02200, 10000=0,01800 (USD); Min Operating Temperature: -55°C; Max Operating Temperature: 155°C; Packaging: Tape and Reel; Number of Terminations: 2; Features: Moisture Resistant; Series: RT; Length: 0.063inch; Width: 0.031inch; Height: 0.022inch; RoHS Compliant: Yes; ComponentLink2URL: http://www.yageo.com/documents/recent/PYu-RT_1-to-0.01_RoHS_L_8.pdf?src-supplier=Digi-Key; ComponentLink2Description: http://www.yageo.com/documents/recent/PYu-RT_1-to-0.01_RoHS_L_8.pdf?src-supplier=Digi-Key
R93 R94 R130 R131 = ERJ-P06F47R0V: RESISTOR SMD FILME 47 OHM 1% 1/2W 0805; Manufacturer: Panasonic; Temperature Coefficient: ±100ppm/°C; Manufacturer Part Number: ERJ-P06F47R0V; Part Number: ERJ-P06F47R0V; Resistance: 47R; Tolerance: ±1%; Package: 0805; Revision: 0; Author: Esdras Bahiano
TP2-TP4 = TP_S2761-46R_SMT: Natural PC Test Point 0.063 x 0.031 x 0.045 (1.60mm x 0.80mm x 1.15mm) Brass, Tin Plating Surface Mount Mounting Type; Manufacturer: Harwin; Supplier: Digi-Key; Supplier Part Number: 952-2665-1-ND; Manufacturer Part Number: S2761-46R; RoHS: Yes; Category: Headers and Wire Housings; Stock: 224369; Pricing: 1=0,31000, 10=0,26400, 25=0,23280, 50=0,21380, 100=0,20540, 250=0,18444, 500=0,17604, 1000=0,14670 (USD); Mounting Technology: Surface Mount; Color: Natural; Plating: Tin; Body Material: Brass; Weight: 0.000212oz; Packaging: Cut Tape; Package Quantity: 3000; Series: S2761, EZ BoardWare; Length: 1.6mm; RoHS Compliant: Yes; ComponentLink1URL: https://cdn.harwin.com/pdfs/S2761R.pdf?src-supplier=Newark; ComponentLink1Description: https://cdn.harwin.com/pdfs/S2761R.pdf?src-supplier=Newark; ComponentLink2URL: https://cdn.harwin.com/pdfs/Harwin_PC_PCB_Hardware.pdf?src-supplier=Mouser; ComponentLink2Description: https://cdn.harwin.com/pdfs/Harwin_PC_PCB_Hardware.pdf?src-supplier=Mouser; ComponentLink3URL: https://cdn.harwin.com/pdfs/Harwin_PC_PCB_Hardware.pdf?src-supplier=Digi-Key; ComponentLink3Description: https://cdn.harwin.com/pdfs/Harwin_PC_PCB_Hardware.pdf?src-supplier=Digi-Key; ComponentLink4URL: https://cdn.harwin.com/pdfs/Harwin_PC_PCB_Hardware.pdf?src-supplier=TTI; ComponentLink4Description: https://cdn.harwin.com/pdfs/Harwin_PC_PCB_Hardware.pdf?src-supplier=TTI
TR1-TR3 = TR_IVY-CT-PCB-03-65A: IVY-CT-PCB-03-65A High Accuracy 0.1 Class 65A 2000:1 10ohm Micro PCB Mount CT Current Transformer; Manufacturer Part Number: IVY-CT-PCB-03-65A
U5 = U_ATM90E32AS_TQFP-48: Smart Energy SoC, 3 - 3.6 VCC, -40 to 85 degC, TQFP-48, RoHS; Manufacturer: Microchip; Interface: SPI; Operating Supply Current: 13mA; Clock Frequency: 16.384MHz; Operating Supply Voltage: 3.3V; Supplier 1: Digi-Key; Category: Uncategorized; Stock 1: 25481; Pricing 1: 1=3,86000, 25=3,54040, 100=3,48000 (USD); Mounting Technology: Surface Mount; Case/Package: TQFP; Pins: 48; Contact Plating: Tin; Min Operating Temperature: -40°C; Max Operating Temperature: 85°C; Packaging: Tray; Package Quantity: 250; Type: Integrated Circuit (IC); Length: 7mm; RoHS Compliant: No; ComponentLink1URL: https://datasheet.ciiva.com/26860/getdatasheetpartid-750855-26860305.pdf?src-supplier=Verical; ComponentLink1Description: https://datasheet.ciiva.com/26860/getdatasheetpartid-750855-26860305.pdf?src-supplier=Verical; ComponentLink2URL: https://datasheet.octopart.com/ATM90E32AS-AU-Y-Microchip-datasheet-62291809.pdf?src-supplier=Upverter; ComponentLink2Description: https://datasheet.octopart.com/ATM90E32AS-AU-Y-Microchip-datasheet-62291809.pdf?src-supplier=Upverter; Supplier Part Number 1: ATM90E32AS-AU-Y-ND
VR1-VR7 = VR_SMT_430V_B72650M0271K072: Varistor, 350V, 8.6J, Surface Mount; Manufacturer: TDK EPCOS; Manufacturer Series: SIOV; Circuit RMS Voltage-Max: 275V; Power: 100mW; Supplier: Digikey; Supplier Part Number: 495-2388-1-ND; Manufacturer Part Number: B72650M0271K072; RoHS: Yes; Category: Varistors; Stock: 6178; Pricing: 1=1,39, 10=0,874, 25=0,738, 100=0,5834, 250=0,50788, 500=0,46162 (USD); Mounting Technology: Surface Mount; Pins: 2; Package Shape: Rectangular; Terminal Finish: Tin; Min Operating Temperature: -40°C; Max Operating Temperature: 85°C; JESD-609 Code: e3; Resistor Type: VARISTOR; Circuit DC Voltage-Max: 350V; Energy Absorbing Capacity-Max: 8.6J; Package Style: DO-214varMeter; Technology: METAL OXIDE FILM; Terminal Placement: Dual; Termination: J BEND; Reach SVHC Compliant: Yes; RoHS Compliant: Yes; ComponentLink1URL: https://datasheet.ciiva.com:443/pdfs/VipMasterIC/IC/EPCO/EPCOS23947/EPCOS23947-1.pdf?src-supplier=IHS+Markit; ComponentLink1Description: https://datasheet.ciiva.com:443/pdfs/VipMasterIC/IC/EPCO/EPCOS23947/EPCOS23947-1.pdf?src-supplier=IHS+Markit; ComponentLink2URL: https://datasheet.ciiva.com/48779/1899738-48779815.pdf?src-supplier=Element14; ComponentLink2Description: https://datasheet.ciiva.com/48779/1899738-48779815.pdf?src-supplier=Element14; ComponentLink3URL: https://datasheet.ciiva.com/48779/1899738-48779816.pdf?src-supplier=Element14; ComponentLink3Description: https://datasheet.ciiva.com/48779/1899738-48779816.pdf?src-supplier=Element14; ComponentLink4URL: https://datasheet.ciiva.com/15155/getdatasheetpartid-89182-15155413.pdf?src-supplier=Verical; ComponentLink4Description: https://datasheet.ciiva.com/15155/getdatasheetpartid-89182-15155413.pdf?src-supplier=Verical
Y3 = Y_16.384MHZ: Crystal 16.384MHz 18pF 4-Pin 3225 T/R; Manufacturer: ECS International; Manufacturer Part Number: ECS-163.84-18-33-JGN-TR3; Supplier: Arrow Electronics; Supplier Part Number: ECS-163.84-18-33-JGN-TR3; RoHS: No; Category: Uncategorized; Stock: 2370; Pricing: 1=0,4169, 10=0,3187, 25=0,3155, 50=0,3086, 100=0,2693, 500=0,2522, 1000=0,2117 (USD)